# Altium schematic sheet Sheet_1.schdoc
size 283 x 155 mm
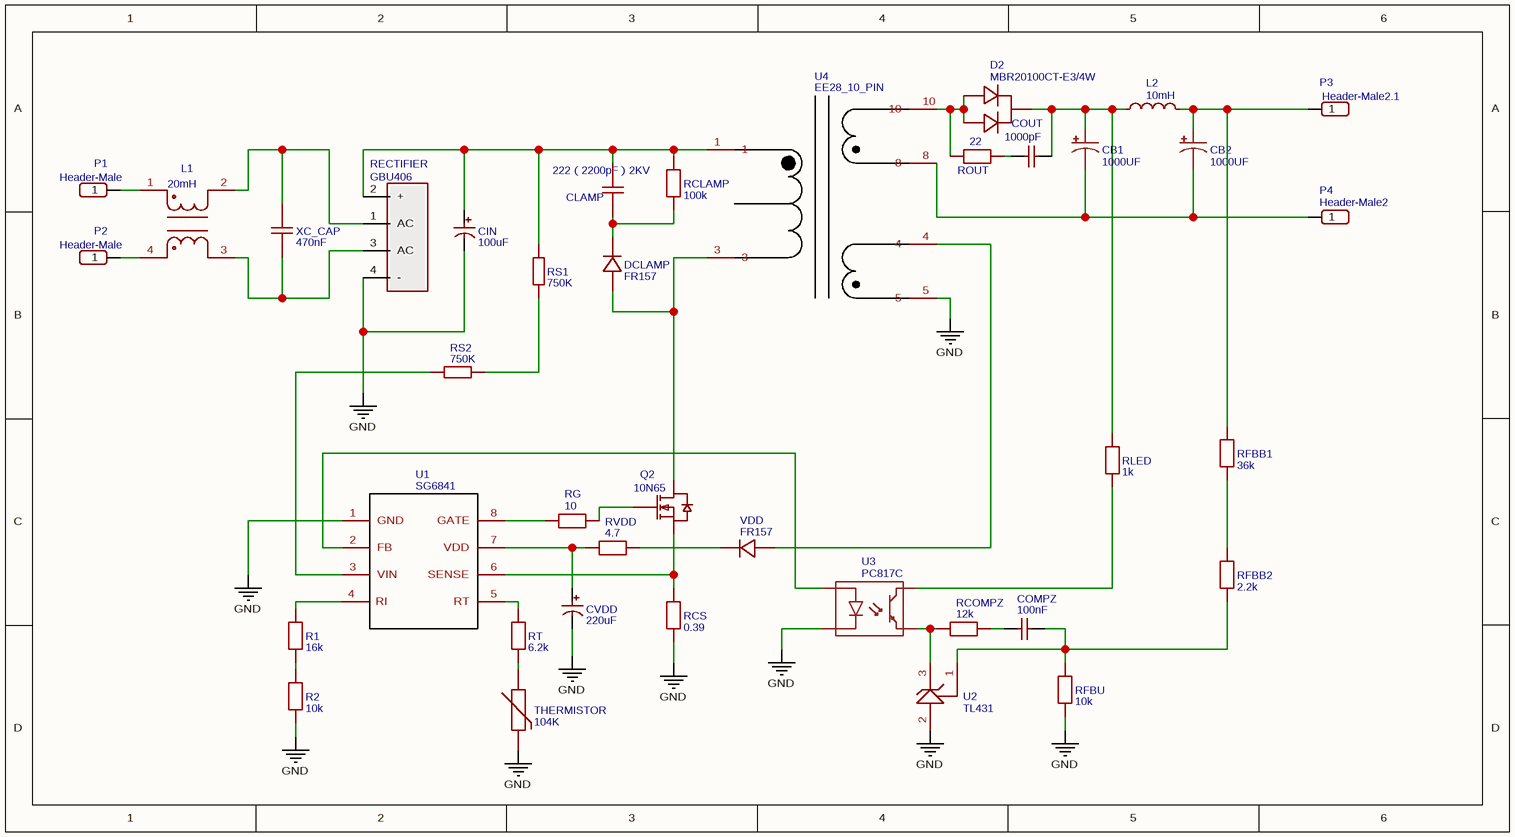
[diagram p0: Sheet_1.schdoc]

## Parts
CB1  1000UF  [CPOL-RADIAL-1000UF-25V-KIT]
CB2  1000UF  [CPOL-RADIAL-1000UF-25V-KIT]
CIN  100uF  [CAP-TH_BD18.0-P7.50-D1.2-FD]
CLAMP  222（2200pF）2KV  [CAP-TH_L5.0-W4.0-P5.00-D1.0-FD]
COMPZ  100nF  [RAD-0.2]
COUT  1000pF  [CAP-12*3-10MM]
CVDD  220uF  [CAP-TH_BD8.0-P3.50-D1.0-FD]
D2  MBR20100CT-E3/4W  [TO-220AB(TO-220-3)]
DCLAMP  FR157  [DO-15]
L1  20mH  [FILTER-TH_4P-L17.0-W12.0-P7.00-D0.6-S8.00]
L2  10mH  [IND-TH_BD8.0-P3.00-D0.6]
P1  Header-Male  [HDR-1X1/2.54]
P2  Header-Male  [HDR-1X1/2.54]
P3  Header-Male2.1  [HDR-1X1/2.54]
P4  Header-Male2  [HDR-1X1/2.54]
Q2  10N65  [TO-220F(TO-220IS)]
R1  16k  [AXIAL-0.4]
R2  10k  [AXIAL-0.4]
RCLAMP  100k  [AXIAL-0.6]
RCOMPZ  12k  [AXIAL-0.4]
RCS  0.39  [AXIAL-0.8]
RECTIFIER  GBU406  [BRIDGE-GBU]
RFBB1  36k  [AXIAL-0.4]
RFBB2  2.2k  [AXIAL-0.4]
RFBU  10k  [AXIAL-0.4]
RG  10  [AXIAL-0.3]
RLED  1k  [AXIAL-0.4]
ROUT  22  [AXIAL-0.4]
RS1  750K  [RES-TH_BD2.3-L6.5-P10.50-D0.5]
RS2  750K  [RES-TH_BD2.3-L6.5-P10.50-D0.5]
RT  6.2k  [AXIAL-0.4]
RVDD  4.7  [AXIAL-0.4]
THERMISTOR  104K  [RES-TH_L6.5-W4.0-P2.50-D0.5]
U1  SG6841  [DIP8]
U2  TL431  [TO-92(TO-92-3)]
U3  PC817C  [DIP4]
U4  EE28_10_PIN  [TRANSFORMER_EE28_10PIN]
VDD  FR157  [DO-15]
XC_CAP  470nF  [CAP-SAFE-18.0*10.0]

## Nets
GND: CIN.2 CVDD.2 R2.1 RCS.1 RECTIFIER.4(-) RFBU.1 THERMISTOR.1 U1.1(GND) U2.2(ANODE) U3.2(K) U4.5
NetCB1_+: CB1.+ COUT.2 D2.2 L2.1 RLED.2
NetCB1_-: CB1.- CB2.- P4.1 U4.8
NetCB2_+: CB2.+ L2.2 P3.1 RFBB1.2
NetCIN_1: CIN.1 CLAMP.2 RCLAMP.2 RECTIFIER.2(+) RS1.2 U4.1
NetCLAMP_1: CLAMP.1 DCLAMP.2(K) RCLAMP.1
NetCOMPZ_1: COMPZ.1 RCOMPZ.2
NetCOMPZ_2: COMPZ.2 RFBB2.1 RFBU.2 U2.1(REF)
NetCOUT_1: COUT.1 ROUT.2
NetCVDD_1: CVDD.1 RVDD.1 U1.7(VDD)
NetD2_1: D2.1 D2.3 ROUT.1 U4.10
NetDCLAMP_1: DCLAMP.1(A) Q2.2(D) U4.3
NetL1_1: L1.1 P1.1
NetL1_2: L1.2 RECTIFIER.1(AC) XC_CAP.1
NetL1_3: L1.3 RECTIFIER.3(AC) XC_CAP.2
NetL1_4: L1.4 P2.1
NetQ2_1: Q2.1(G) RG.2
NetQ2_3: Q2.3(S) RCS.2 U1.6(SENSE)
NetR1_1: R1.1 R2.2
NetR1_2: R1.2 U1.4(RI)
NetRCOMPZ_1: RCOMPZ.1 U2.3(CATHODE) U3.3(E)
NetRFBB1_1: RFBB1.1 RFBB2.2
NetRG_1: RG.1 U1.8(GATE)
NetRLED_1: RLED.1 U3.4(C)
NetRS1_1: RS1.1 RS2.2
NetRS2_1: RS2.1 U1.3(VIN)
NetRT_1: RT.1 THERMISTOR.2
NetRT_2: RT.2 U1.5(RT)
NetRVDD_2: RVDD.2 VDD.2(K)
NetU1_2: U1.2(FB) U3.1(A)
NetU4_4: U4.4 VDD.1(A)

## Library data of the parts
CB1 CB2 = 1000UF: description: CAP-08070; Contributor: SparkFun; spicePre: C
CIN = 100uF: BOM_Manufacturer: ValuePro; BOM_Manufacturer Part: 400V 100uF 18X30; nameAlias: Capacitance; BOM_Supplier: LCSC; BOM_Supplier Part: C2767; spicePre: C; spiceSymbolName: 400V 100uF 18X30
CLAMP = 222（2200pF）2KV: BOM_Manufacturer: ReliaPro; Value: 2.2nF; BOM_Supplier Part: C24926; BOM_Supplier: LCSC; BOM_Manufacturer Part: 222（2200pF）2KV; image: http://image.lceda.cn/szlcsc/C24926.jpg; spicePre: C
COMPZ = 100nF: BOM_Manufacturer: ReliaPro; BOM_Manufacturer Part: 104/100V 20%; nameAlias: Capacitance; BOM_Supplier: LCSC; BOM_Supplier Part: C26856; spicePre: C; spiceSymbolName: 104/100V 20%
COUT = 1000pF: BOM_Manufacturer: ReliaPro; BOM_Manufacturer Part: 102M 400V Y5V; nameAlias: Value; BOM_Supplier: LCSC; BOM_Supplier Part: C3704; spicePre: C; spiceSymbolName: 102M 400V Y5V
CVDD = 220uF: BOM_Manufacturer: ValuePro; BOM_Manufacturer Part: 220uf/35V; nameAlias: Capacitance; BOM_Supplier: LCSC; BOM_Supplier Part: C2063; spicePre: C; spiceSymbolName: 220uf/35V
D2 = MBR20100CT-E3/4W: BOM_Manufacturer: Vishay Intertech; Contributor: LCSC; BOM_Supplier: LCSC; BOM_Supplier Part: C222466; BOM_Manufacturer Part: MBR20100CT-E3/4W; spicePre: D
DCLAMP VDD = FR157: BOM_Manufacturer: MDD; BOM_Supplier: LCSC; BOM_Manufacturer Part: FR157; image: //image.lceda.cn/szlcsc/C2467.jpg; BOM_Supplier Part: C2467; spicePre: D
L1 = 20mH: BOM_Manufacturer: Guangdong Fenghua Advanced Tech; BOM_Manufacturer Part: UU9.8-10mH; nameAlias: Value; Contributor: LCSC; BOM_Supplier: LCSC; BOM_Supplier Part: C148474; spicePre: L; spiceSymbolName: UU9.8-10MH
L2 = 10mH: BOM_Manufacturer: FH; BOM_Manufacturer Part: VLU0608-103K; nameAlias: Inductance; BOM_Supplier: LCSC; BOM_Supplier Part: C72613; spicePre: L; spiceSymbolName: VLU0608-103K
P1 P2 = Header-Male: BOM_Manufacturer: ReliaPro; BOM_Manufacturer Part: Header-Male-2.54_1x1; BOM_Supplier: LCSC; BOM_Supplier Part: C81276; spicePre: P
P3 = Header-Male2.1: BOM_Manufacturer: ReliaPro; BOM_Manufacturer Part: Header-Male-2.54_1x1; BOM_Supplier: LCSC; BOM_Supplier Part: C81276; spicePre: P
P4 = Header-Male2: BOM_Manufacturer: ReliaPro; BOM_Manufacturer Part: Header-Male-2.54_1x1; BOM_Supplier: LCSC; BOM_Supplier Part: C81276; spicePre: P
Q2 = 10N65: BOM_Manufacturer: UTC; BOM_Manufacturer Part: 10N65KL-TF3-T; BOM_Supplier: LCSC; image: //image.lceda.cn/szlcsc/C74166.jpg; BOM_Supplier Part: C74166; spicePre: Q
R1 = 16k: nameAlias: Value(Ω); spicePre: R; spiceSymbolName: Res_AXIAL-0.4(1/4W)_EU
R2 RFBU = 10k: nameAlias: Value(Ω); spicePre: R; spiceSymbolName: Res_AXIAL-0.4(1/4W)_EU
RCLAMP = 100k: nameAlias: Value(Ω); spicePre: R; spiceSymbolName: Res_AXIAL-0.6(1W)_EU
RCOMPZ = 12k: nameAlias: Value(Ω); spicePre: R; spiceSymbolName: Res_AXIAL-0.4(1/4W)_EU
RCS = 0.39: nameAlias: Value(Ω); spicePre: R; spiceSymbolName: Res_AXIAL-0.8(2W)_EU
RECTIFIER = GBU406: BOM_Manufacturer: MDD; BOM_Manufacturer Part: GBU406 Rectifier bridge; BOM_Supplier: LCSC; image: //image.lceda.cn/szlcsc/C13432.jpg; BOM_Supplier Part: C13432; spicePre: D
RFBB1 = 36k: nameAlias: Value(Ω); spicePre: R; spiceSymbolName: Res_AXIAL-0.4(1/4W)_EU
RFBB2 = 2.2k: nameAlias: Value(Ω); spicePre: R; spiceSymbolName: Res_AXIAL-0.4(1/4W)_EU
RG = 10: nameAlias: Value(Ω); spicePre: R; spiceSymbolName: Res_AXIAL-0.3(1/8W)_EU
RLED = 1k: nameAlias: Value(Ω); spicePre: R; spiceSymbolName: Res_AXIAL-0.4(1/4W)_EU
ROUT = 22: nameAlias: Value(Ω); spicePre: R; spiceSymbolName: Res_AXIAL-0.4(1/4W)_EU
RS1 RS2 = 750K: BOM_Manufacturer: Chian Chia Elec; nameAlias: Resistance (Ohms); Contributor: LCSC; BOM_Supplier: LCSC; BOM_Supplier Part: C119386; BOM_Manufacturer Part: -; spicePre: R; spiceSymbolName: MF1/4W-750KΩ±1% T52
RT = 6.2k: nameAlias: Value(Ω); spicePre: R; spiceSymbolName: Res_AXIAL-0.4(1/4W)_EU
RVDD = 4.7: nameAlias: Value(Ω); spicePre: R; spiceSymbolName: Res_AXIAL-0.4(1/4W)_EU
THERMISTOR = 104K: BOM_Manufacturer: Shiheng; BOM_Manufacturer Part: MF11-104K; nameAlias: Value; BOM_Supplier: LCSC; BOM_Supplier Part: C40773; spicePre: R; spiceSymbolName: MF11-104K
U1 = SG6841: Contributor: OpvS0OU3iRgTi1deEJgjG; sourceId: H1cMKkUtr; timeStamp: 1474288800; spicePre: U
U2 = TL431: BOM_Manufacturer: TI; BOM_Manufacturer Part: TL431AILP; Contributor: LCSC; BOM_Supplier: LCSC; BOM_Supplier Part: C72108; spicePre: U
U3 = PC817C: nameAlias: Model; sourceId: GMlVvHhfc; spicePre: X; model: PC817C; link: https://www.farnell.com/datasheets/73758.pdf; spiceSymbolName: PC817C
U4 = EE28_10_PIN: Contributor: kevwe; BOM_Manufacturer Part: EE28_10_PIN; BOM_Supplier Part: undefined; link: https://www.alldatasheet.com/datasheet-pdf/pdf/461251/NEC/FEE28S.html; spicePre: U
XC_CAP = 470nF: BOM_Manufacturer: Tongfeng; nameAlias: Capacitance; Contributor: LCSC; BOM_Supplier: LCSC; BOM_Supplier Part: C281974; BOM_Manufacturer Part: -; spicePre: C; spiceSymbolName: MKP-0.47uF275V ±10%